# Altium project DS18B20.PrjPcb
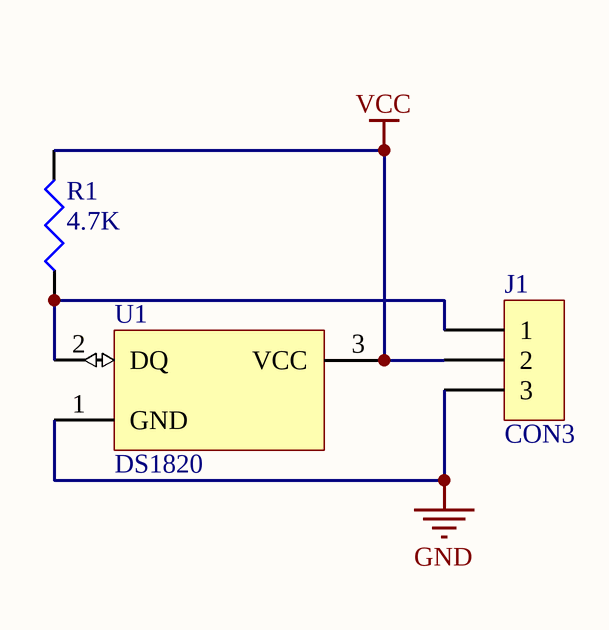
[diagram p0: DS18B20.SchDoc]
1 sheet, 3 parts. Net scope: global (net labels, ports and power ports of the same name join across sheets).
Board file: DS18B20.PcbDoc

## Sheet DS18B20.SchDoc
size A4

### Parts
J1  CON3  [DevModule]
R1  4.7K  [6-0805_N]
U1  DS1820  [PR35]

### Nets
GND: J1.3 U1.1(GND)
VCC: J1.2 R1.2 U1.3(VCC)
NetJ1_1: J1.1 R1.1 U1.2(DQ)

### Library data of the parts
J1 = CON3: Connector
R1 = RES1_1
U1 = DS1820: 1-Wire Digital Thermometer; ComponentAvailability: Obsolete; Published: 13-Oct-2000; LatestRevisionDate: 17-Jul-2002; LatestRevisionNote: Re-released for DXP Platform.; DatasheetVersion: 5-Mar-1998; PackageVersion: 1999; PackageReference: PR35; Publisher: Altium Limited; PackageDescription: TO, Flat Index; 3 In-Line, Axial Leads; Body Dia. 4.6mm; Leads 0.56 x 0.51 mm (max); ComponentLink1Description: Manufacturer Link; ComponentLink1URL: http://www.maxim-ic.com/; ComponentLink2Description: Datasheet; ComponentLink2URL: http://pdfserv.maxim-ic.com/en/ds/DS1820-DS1820S.pdf; ComponentLink3Description: Discontinuation Notice; ComponentLink3URL: http://www.maxim-ic.com/qa/pdfs/non-obsolescence-letter.pdf